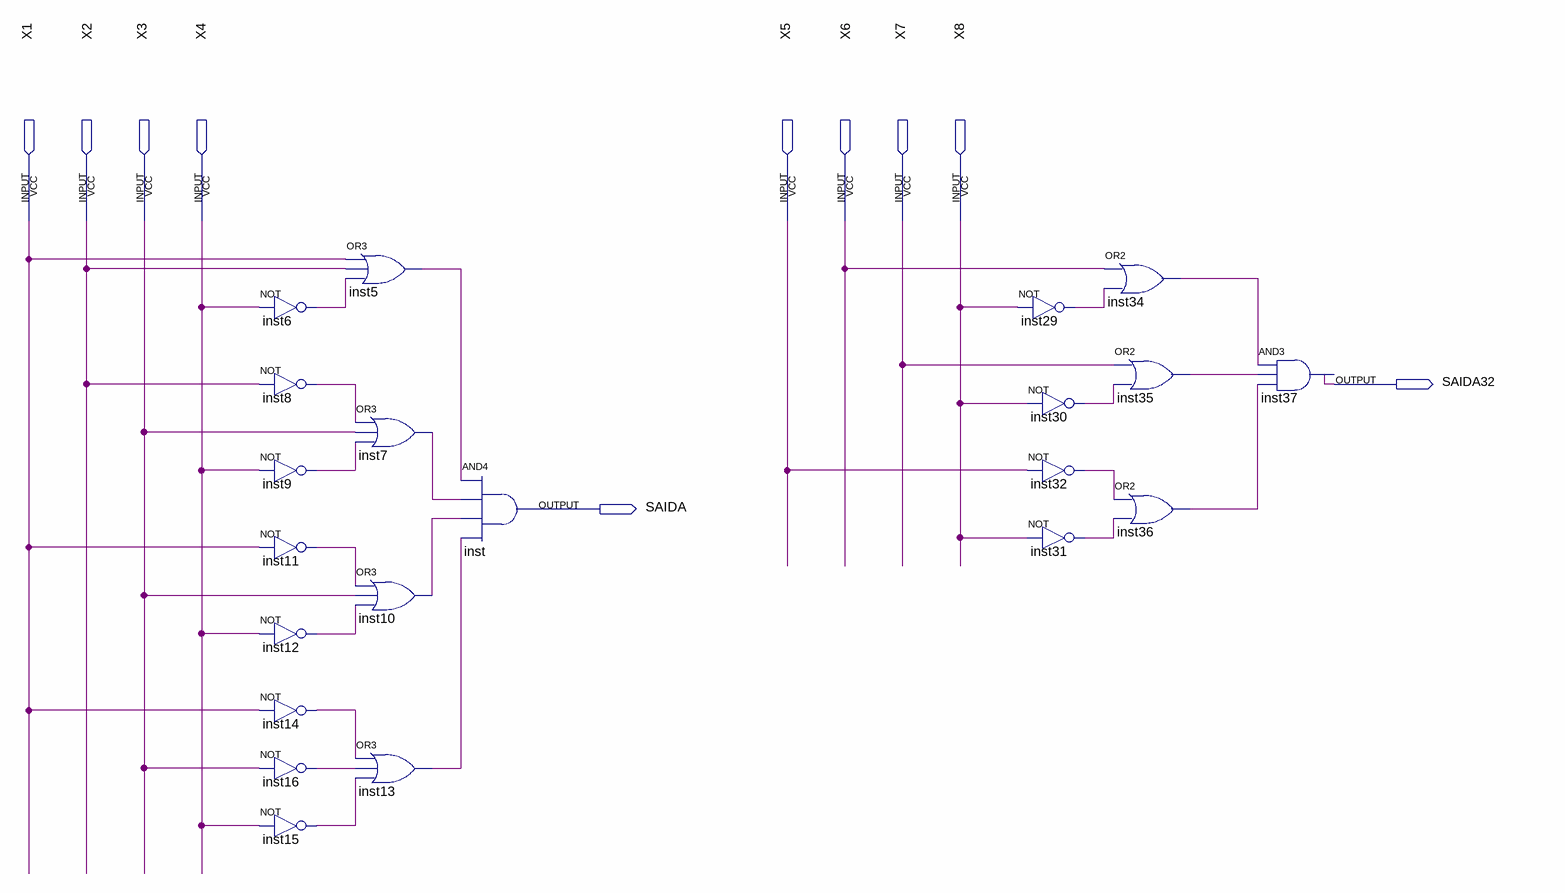
[diagram p0: schematic sheet]
// Quartus schematic exerc02.bdf as structural Verilog: 21 symbols, 10 pins
module exerc02 (
  input  X1,
  input  X2,
  input  X3,
  input  X4,
  input  X5,
  input  X6,
  input  X7,
  input  X8,
  output SAIDA32,
  output SAIDA
);

  wire inst5_out, inst6_out, inst7_out, inst8_out, inst9_out, inst10_out, inst11_out, inst12_out, inst13_out,
       inst14_out, inst15_out, inst16_out, inst29_out, inst30_out, inst31_out, inst32_out, inst34_out,
       inst35_out, inst36_out;

  not inst6 (inst6_out, X4);
  not inst8 (inst8_out, X2);
  not inst9 (inst9_out, X4);
  not inst11 (inst11_out, X1);
  not inst12 (inst12_out, X4);
  not inst14 (inst14_out, X1);
  not inst16 (inst16_out, X3);
  not inst15 (inst15_out, X4);
  or inst5 (inst5_out, X1, X2, inst6_out);
  or inst7 (inst7_out, inst8_out, X3, inst9_out);
  or inst10 (inst10_out, inst11_out, X3, inst12_out);
  or inst13 (inst13_out, inst14_out, inst16_out, inst15_out);
  and inst (SAIDA, inst5_out, inst7_out, inst10_out, inst13_out);
  not inst29 (inst29_out, X8);
  not inst30 (inst30_out, X8);
  not inst32 (inst32_out, X5);
  not inst31 (inst31_out, X8);
  or inst34 (inst34_out, X6, inst29_out);
  or inst35 (inst35_out, X7, inst30_out);
  or inst36 (inst36_out, inst32_out, inst31_out);
  and inst37 (SAIDA32, inst34_out, inst35_out, inst36_out);
endmodule
